# Altium schematic sheet 20190906TPS40200CV学生版.SchDoc
size A4; SheetNumber: 0; SheetTotal: 0; PageSetup: Record=PageOptions|CenterHorizontal=True|CenterVertical=True|PrintScale=1.00|XCorrection=1.00|YCorrection=1.00|PrintKind=0|BorderSize=5000000|LeftOffset=0|BottomOffset=0|Orientation=2|PaperLength=1000|PaperWidth=1000|Scale=100|PaperSource=7|PrintQuality=-4|MediaType=1|DitherType=10|PaperKind=A4|PrintScaleMode=1
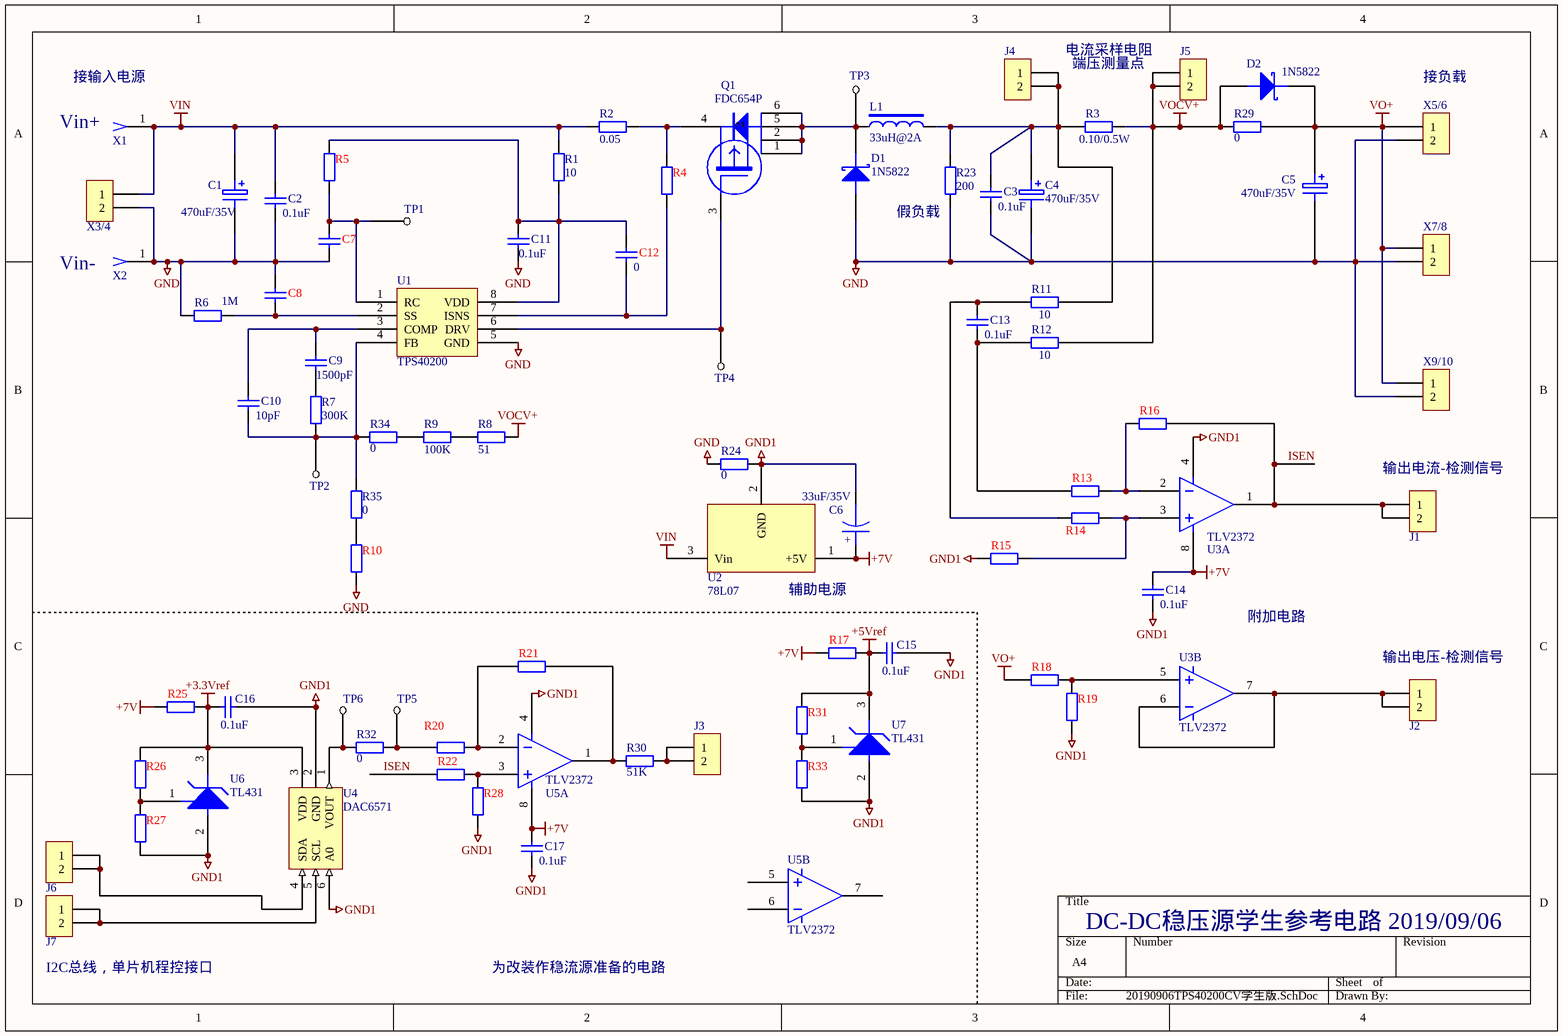
[diagram p0: 20190906TPS40200CV学生版.SchDoc]

## Parts
C1  470uF/35V  [RB5-10.5]
C2  0.1uF  [0805-1]
C3  0.1uF  [0805-1]
C4  470uF/35V  [RB5-10.5]
C5  470uF/35V  [RB5-10.5]
C6  33uF/35V  [C-RB-8]
C7  (no value)  [0805-1]
C8  (no value)  [0805-1]
C9  1500pF  [0805-1]
C10  10pF  [0805-1]
C11  0.1uF  [0805-1]
C12  0  [0805-1]
C13  0.1uF  [0805-1]
C14  0.1uF  [0805-1]
C15  0.1uF  [CC2012-0805]
C16  0.1uF  [0805-1]
C17  0.1uF  [0805-1]
D1  1N5822  [DIODE-0.7]
D2  1N5822  [DIODE-0.7]
J1  SIP2  [HDR1X2]  (value not drawn)
J2  SIP2  [HDR1X2]  (value not drawn)
J3  SIP2  [HDR1X2]  (value not drawn)
J4  SIP2  [HDR1X2]  (value not drawn)
J5  SIP2  [HDR1X2]  (value not drawn)
J6  SIP2  [HDR1X2]  (value not drawn)
J7  SIP2  [HDR1X2]  (value not drawn)
L1  33uH@2A  [L2]
Q1  FDC654P  [SOT23-6]
R1  10  [0805-1]
R2  0.05  [2512]
R3  0.10/0.5W  [2512]
R4  (no value)  [0805-1]
R5  (no value)  [0805-1]
R6  1M  [0805-1]
R7  300K  [0805-1]
R8  51  [0805-1]
R9  100K  [0805-1]
R10  (no value)  [0805-1]
R11  10  [0805-1]
R12  10  [0805-1]
R13  (no value)  [0805-1]
R14  (no value)  [0805-1]
R15  (no value)  [0805-1]
R16  (no value)  [0805-1]
R17  (no value)  [CC2012-0805]
R18  (no value)  [0805-1]
R19  (no value)  [0805-1]
R20  (no value)  [0805-1]
R21  (no value)  [0805-1]
R22  (no value)  [0805-1]
R23  200  [0805-1]
R24  0  [0805-1]
R25  (no value)  [0805-1]
R26  (no value)  [0805-1]
R27  (no value)  [0805-1]
R28  (no value)  [0805-1]
R29  0  [0805-1]
R30  51K  [0805-1]
R31  (no value)  [CC2012-0805]
R32  0  [CC2012-0805]
R33  (no value)  [CC2012-0805]
R34  0  [CC2012-0805]
R35  0  [CC2012-0805]
TP1  NULL  [PIN1]  (value not drawn)
TP2  NULL  [PIN1]  (value not drawn)
TP3  NULL  [PIN1]  (value not drawn)
TP4  NULL  [PIN1]  (value not drawn)
TP5  NULL  [PIN1]  (value not drawn)
TP6  NULL  [PIN1]  (value not drawn)
U1  TPS40200  [SOIC8_N]
U2  78L07  [TO-92A]
U3  TLV2372  [DIP8]  (parts A,B of 2)
U4  DAC6571  [SOT23-6]
U5  TLV2372  [DIP8]  (parts A,B of 2)
U6  TL431  [TO-92A]
U7  TL431  [TO-92A]
X1  BANANA  [HOLE 6-13]  (value not drawn)
X2  BANANA  [HOLE 6-13]  (value not drawn)
X3/4  PIN2-160mil  [SH30]  (value not drawn)
X5/6  PIN2-160mil  [SH30]  (value not drawn)
X7/8  PIN2-160mil  [SH30]  (value not drawn)
X9/10  PIN2-160mil  [SH30]  (value not drawn)

## Nets
+3.3Vref: C16.1 R25.2 R26.1 U4.3(VDD) U6.3(K)
+5Vref: C15.1 R17.2 R31.1 U7.3(K)
+7V: C6.1 C14.1 C17.1 R17.1 R25.1 U2.1(+5V) U3.8 U5.8
GND: C1.2 C2.2 C3.2 C4.2 C5.2 C7.2 C8.1 C11.2 D1.1 R6.2 R10.1 R23.1 R24.1 U1.5(GND) X2.1 X3/4.2 X5/6.2 X7/8.2 X9/10.2
GND1: C6.2 C14.2 C15.2 C16.2 C17.2 R15.2 R19.1 R24.2 R27.2 R28.1 R33.2 U2.2(GND) U3.4 U4.2(GND) U4.6(A0) U5.4 U6.2(A) U7.2(A)
VIN: C1.1 C2.1 R1.2 R2.2 U2.3(Vin) X1.1 X3/4.1
VO+: C5.1 D2.2 R18.2 R29.2 X5/6.1 X7/8.1 X9/10.1
VOCV+: D2.1 J5.1 J5.2 R3.1 R8.1 R12.1 R29.1
ISEN: J1.1 J1.2 R16.1 R22.2 U3.1
NetC3_1: C3.1 C4.1 J4.1 J4.2 L1.10 R3.2 R11.1 R23.2
NetC7_1: C7.1 R5.1 TP1.1 U1.1(RC)
NetC8_2: C8.2 R6.1 U1.2(SS)
NetC9_1: C9.1 C10.1 U1.3(COMP)
NetC9_2: C9.2 R7.2
NetC10_2: C10.2 R7.1 R34.1 R35.2 TP2.1 U1.4(FB)
NetC11_1: C11.1 C12.1 R1.1 R5.2 U1.8(VDD)
NetC12_2: C12.2 R4.1 U1.7(ISNS)
NetC13_1: C13.1 R12.2 R13.2
NetC13_2: C13.2 R11.2 R14.2
NetD1_2: D1.2 L1.1 Q1.1(D) Q1.2(D) Q1.5(D) Q1.6(D) TP3.1
NetJ2_1: J2.1 J2.2 U3.6 U3.7
NetJ3_1: J3.1 J3.2 R30.1
NetJ6_1: J6.1 J6.2 U4.4(SDA)
NetJ7_1: J7.1 J7.2 U4.5(SCL)
NetQ1_3: Q1.3(G) TP4.1 U1.6(DRV)
NetQ1_4: Q1.4(S) R2.1 R4.2
NetR8_2: R8.2 R9.1
NetR9_2: R9.2 R34.2
NetR10_2: R10.2 R35.1
NetR13_1: R13.1 R16.2 U3.2
NetR14_1: R14.1 R15.1 U3.3
NetR18_1: R18.1 R19.2 U3.5
NetR20_1: R20.1 R21.2 U5.2
NetR20_2: R20.2 R32.2 TP5.1
NetR21_1: R21.1 R30.2 U5.1
NetR22_1: R22.1 R28.2 U5.3
NetR26_2: R26.2 R27.1 U6.1(R)
NetR31_2: R31.2 R33.1 U7.1(R)
NetR32_1: R32.1 TP6.1 U4.1(VOUT)

Not connected (* = marked no-connect by the designer): U5 5 6 7

## Notes on the sheet
- (near X1) 接输入电源
- (near J4) 电流采样电阻
- 端压测量点
- (near X5/6) 接负载
- (near X1) Vin+
- 假负载
- (near X2) Vin-
- (near J1) 输出电流-检测信号
- (near U2) 辅助电源
- 附加电路
- (near J2) 输出电压-检测信号
- (near J7) I2C总线，单片机程控接口
- 为改装作稳流源准备的电路
- DC-DC稳压源学生参考电路 2019/09/06
- (in symbol CAPACITOR POL) +

## Library data of the parts
C1 = ELECTRO1: Electrolytic Capacitor; Value: 470p
C2 C3 C9-C11 C14 C17 = Cap: Capacitor; Published: 8-Jun-2000; LatestRevisionDate: 17-Jul-2002; LatestRevisionNote: Re-released for DXP Platform.; PackageReference: RAD-0.3; Publisher: Altium Limited; PackageDescription: Radial Cap, Thru-Hole; 2 Leads; 0.3 in Pin Spacing
  C2 C3 C11 C14 C17: Value: 0.1uF
  C9: Value: 1500pF
  C10: Value: 10pF
C4 = ELECTRO1: Electrolytic Capacitor
C5 = ELECTRO1: Electrolytic Capacitor; Value: 0.1u
C6 = CAPACITOR POL: Capacitor
C7 C8 C12 = Cap: Capacitor; Value: NA; Published: 8-Jun-2000; LatestRevisionDate: 17-Jul-2002; LatestRevisionNote: Re-released for DXP Platform.; PackageReference: RAD-0.3; Publisher: Altium Limited; PackageDescription: Radial Cap, Thru-Hole; 2 Leads; 0.3 in Pin Spacing
C13 = Cap: Capacitor; Value: 33nF; Published: 8-Jun-2000; LatestRevisionDate: 17-Jul-2002; LatestRevisionNote: Re-released for DXP Platform.; PackageReference: RAD-0.3; Publisher: Altium Limited; PackageDescription: Radial Cap, Thru-Hole; 2 Leads; 0.3 in Pin Spacing
C15 C16 = Cap: Capacitor; Value: 100pF; Published: 8-Jun-2000; LatestRevisionDate: 17-Jul-2002; LatestRevisionNote: Re-released for DXP Platform.; PackageReference: RAD-0.3; Publisher: Altium Limited; PackageDescription: Radial Cap, Thru-Hole; 2 Leads; 0.3 in Pin Spacing
D1 D2 = DIODE SCHOTTKY: Schottky Diode
J1-J7 X3/4 X5/6 X7/8 X9/10 = CON2: Connector
L1 = INDUCTOR2: Inductor
Q1 = FDC654P: Mosfet
R1 R2 R6-R9 R11 R12 R23 = Res2: Resistor; Published: 8-Jun-2000; LatestRevisionDate: 17-Jul-2002; LatestRevisionNote: Re-released for DXP Platform.; PackageReference: AXIAL-0.4; Publisher: Altium Limited; PackageDescription: Axial Device, Thru-Hole; 2 Leads; 0.4 in Pin Spacing
  R1 R11 R12: Value: 10
  R2: Value: 0.05
  R6: Value: 1M
  R7: Value: 300K
  R8: Value: 51
  R9: Value: 100K
  R23: Value: 200
R3 = Res2: Resistor; Value: 0.1/0.5W; Published: 8-Jun-2000; LatestRevisionDate: 17-Jul-2002; LatestRevisionNote: Re-released for DXP Platform.; PackageReference: AXIAL-0.4; Publisher: Altium Limited; PackageDescription: Axial Device, Thru-Hole; 2 Leads; 0.4 in Pin Spacing
R4 R5 R10 R13-R22 R25-R28 R31 R33 = Res2: Resistor; Value: NA; Published: 8-Jun-2000; LatestRevisionDate: 17-Jul-2002; LatestRevisionNote: Re-released for DXP Platform.; PackageReference: AXIAL-0.4; Publisher: Altium Limited; PackageDescription: Axial Device, Thru-Hole; 2 Leads; 0.4 in Pin Spacing
R24 R29 R30 R32 R34 R35 = Res2: Resistor; Value: 1K; Published: 8-Jun-2000; LatestRevisionDate: 17-Jul-2002; LatestRevisionNote: Re-released for DXP Platform.; PackageReference: AXIAL-0.4; Publisher: Altium Limited; PackageDescription: Axial Device, Thru-Hole; 2 Leads; 0.4 in Pin Spacing
TP1-TP6 = TEST
U1 = TPS40200: Chip
U2 = MC7805T: Chip
U3 U5 = 1458: Chip
U4 = DAC6571: Chip
U6 U7 = TL431: Chip
X1 X2 = INPUT: Connector